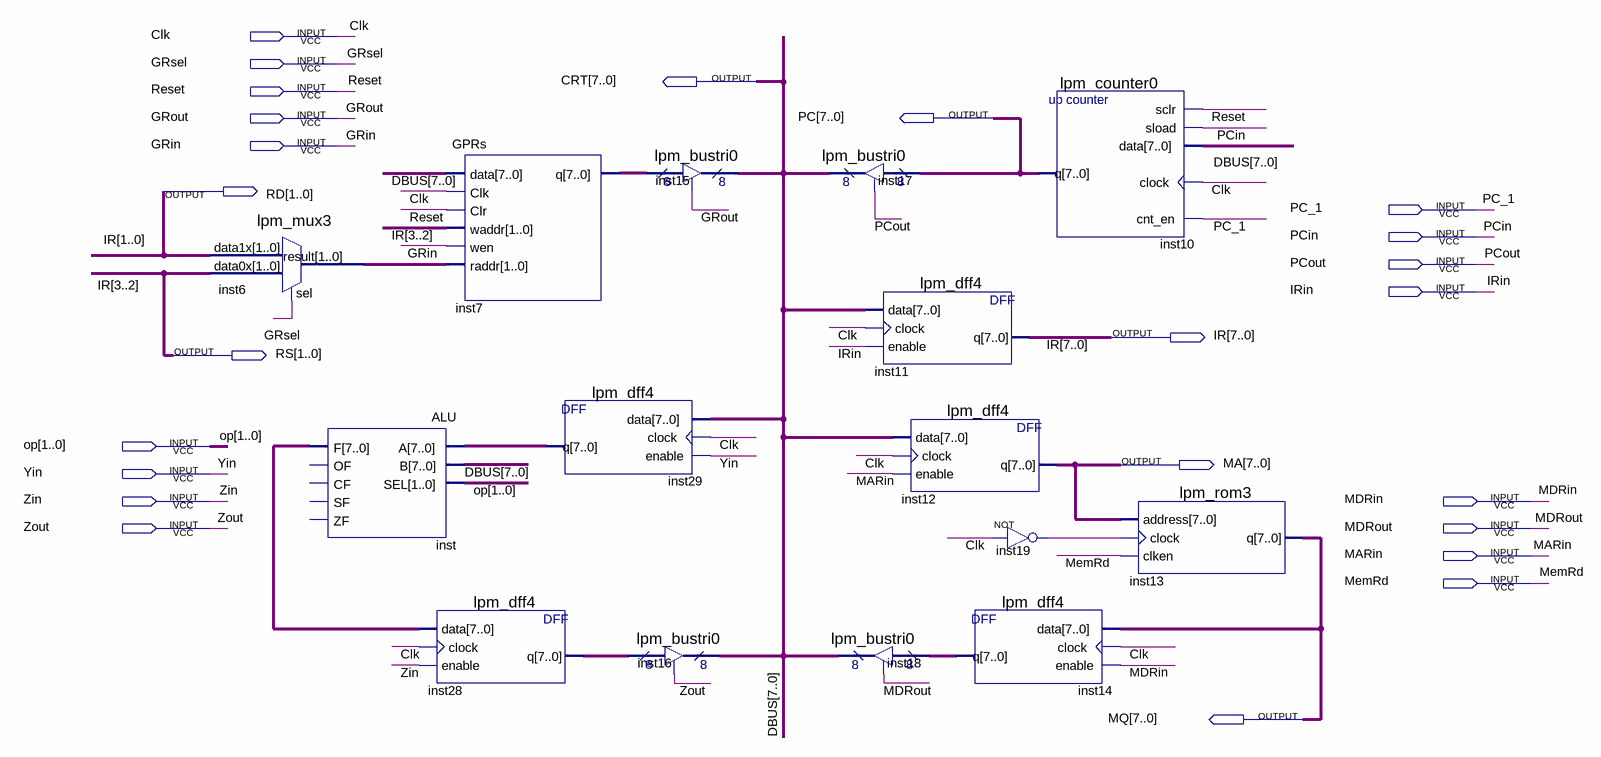
[diagram p0: schematic sheet]
// Quartus schematic DataPath.bdf as structural Verilog: 15 symbols, 24 pins
module DataPath (
  input  Clk,
  input  GRsel,
  input  Reset,
  input  GRout,
  input  GRin,
  input  PC_1,
  input  PCin,
  input  PCout,
  input  IRin,
  input  [1:0] op,
  input  Yin,
  input  Zin,
  input  MDRin,
  input  Zout,
  input  MDRout,
  input  MARin,
  input  MemRd,
  output [7:0] CRT,
  output [7:0] PC,
  output [1:0] RD,
  output [7:0] IR,
  output [1:0] RS,
  output [7:0] MA,
  output [7:0] MQ
);

  wire inst19_out;
  wire [1:0] inst6_result;
  wire [7:0] inst7_q, inst14_q, inst28_q, inst29_q, inst_f;

  lpm_mux3 inst6 (.data1x(IR[1:0]), .data0x(IR[3:2]), .sel(GRsel), .result(inst6_result));
  ALU inst (.A(inst29_q), .B(CRT), .SEL(op), .F(inst_f));  // open: OF, CF, SF, ZF
  lpm_dff4 inst28 (.data(inst_f), .clock(Clk), .enable(Zin), .q(inst28_q));
  GPRs inst7 (.data(CRT), .Clk(Clk), .Clr(Reset), .waddr(IR[3:2]), .wen(GRin), .raddr(inst6_result), .q(inst7_q));
  lpm_dff4 inst29 (.data(CRT), .clock(Clk), .enable(Yin), .q(inst29_q));
  lpm_bustri0 inst15 (.enabledt(GRout), .data(inst7_q), .tridata(CRT));
  lpm_bustri0 inst16 (.enabledt(Zout), .data(inst28_q), .tridata(CRT));
  lpm_bustri0 inst17 (.enabledt(PCout), .data(PC), .tridata(CRT));
  lpm_dff4 inst11 (.data(CRT), .clock(Clk), .enable(IRin), .q(IR));
  lpm_bustri0 inst18 (.enabledt(MDRout), .data(inst14_q), .tridata(CRT));
  lpm_dff4 inst12 (.data(CRT), .clock(Clk), .enable(MARin), .q(MA));
  not inst19 (inst19_out, Clk);
  lpm_dff4 inst14 (.data(MQ), .clock(Clk), .enable(MDRin), .q(inst14_q));
  lpm_counter0 inst10 (.sclr(Reset), .sload(PCin), .data(CRT), .clock(Clk), .cnt_en(PC_1), .q(PC));
  lpm_rom3 inst13 (.address(MA), .clock(inst19_out), .clken(MemRd), .q(MQ));

  assign RD = IR[1:0];
  assign RS = IR[3:2];

  // Other names for the same wires on the sheet: DBUS[7:0] = CRT
endmodule
